# Altium project OBC_PhaseI.PrjPcb
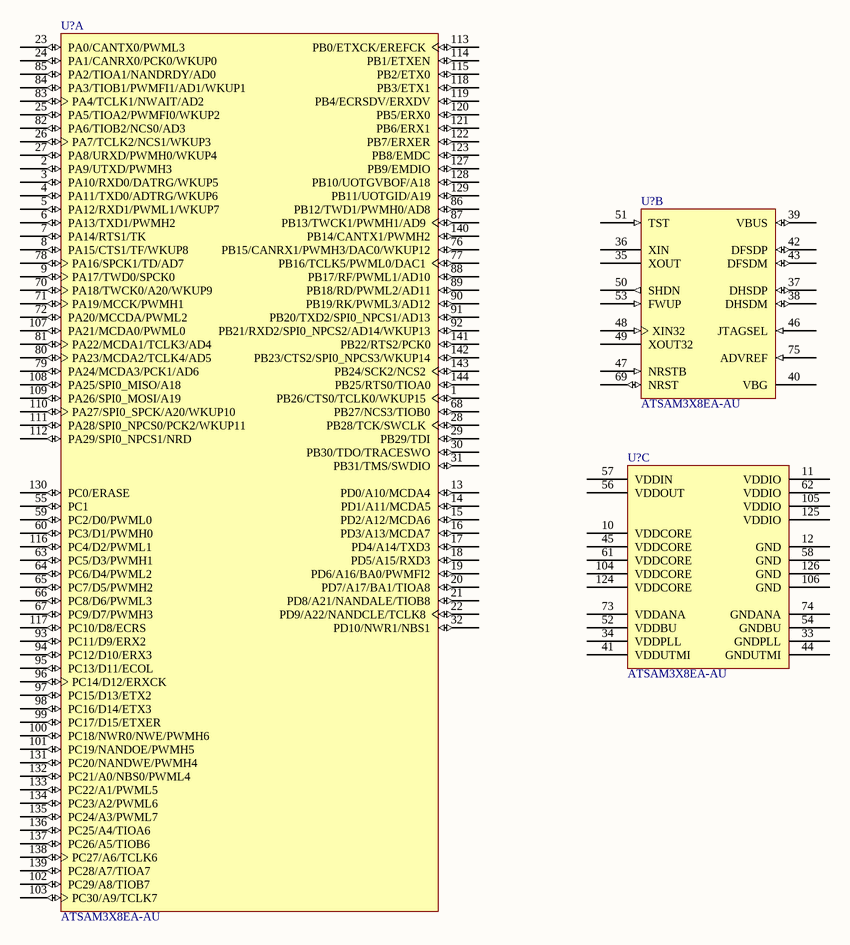
[diagram p0: OBC.SchDoc]
1 sheet, 3 parts. Net scope: global (net labels, ports and power ports of the same name join across sheets).

## Sheet OBC.SchDoc
size A4

### Parts
(Parts that share a designator on the sheet are numbered #1, #2 ... from top to bottom, then left to right.)
U?#1  ATSAM3X8EA-AU  [LQFP144_L]  (part A of 3)
U?#2  ATSAM3X8EA-AU  [LQFP144_L]  (part B of 3)
U?#3  ATSAM3X8EA-AU  [LQFP144_L]  (part C of 3)

### Nets

Not connected (* = marked no-connect by the designer): U?#1 1(PB26/CTS0/TCLK0/WKUP15) 2(PA9/UTXD/PWMH3) 3(PA10/RXD0/DATRG/WKUP5) 4(PA11/TXD0/ADTRG/WKUP6) 5(PA12/RXD1/PWML1/WKUP7) 6(PA13/TXD1/PWMH2) 7(PA14/RTS1/TK) 8(PA15/CTS1/TF/WKUP8) 9(PA17/TWD0/SPCK0) 13(PD0/A10/MCDA4) 14(PD1/A11/MCDA5) 15(PD2/A12/MCDA6) 16(PD3/A13/MCDA7) 17(PD4/A14/TXD3) 18(PD5/A15/RXD3) 19(PD6/A16/BA0/PWMFI2) 20(PD7/A17/BA1/TIOA8) 21(PD8/A21/NANDALE/TIOB8) 22(PD9/A22/NANDCLE/TCLK8) 23(PA0/CANTX0/PWML3) 24(PA1/CANRX0/PCK0/WKUP0) 25(PA5/TIOA2/PWMFI0/WKUP2) 26(PA7/TCLK2/NCS1/WKUP3) 27(PA8/URXD/PWMH0/WKUP4) 28(PB28/TCK/SWCLK) 29(PB29/TDI) 30(PB30/TDO/TRACESWO) 31(PB31/TMS/SWDIO) 32(PD10/NWR1/NBS1) 55(PC1) 59(PC2/D0/PWML0) 60(PC3/D1/PWMH0) 63(PC5/D3/PWMH1) 64(PC6/D4/PWML2) 65(PC7/D5/PWMH2) 66(PC8/D6/PWML3) 67(PC9/D7/PWMH3) 68(PB27/NCS3/TIOB0) 70(PA18/TWCK0/A20/WKUP9) 71(PA19/MCCK/PWMH1) 72(PA20/MCCDA/PWML2) 76(PB15/CANRX1/PWMH3/DAC0/WKUP12) 77(PB16/TCLK5/PWML0/DAC1) 78(PA16/SPCK1/TD/AD7) 79(PA24/MCDA3/PCK1/AD6) 80(PA23/MCDA2/TCLK4/AD5) 81(PA22/MCDA1/TCLK3/AD4) 82(PA6/TIOB2/NCS0/AD3) 83(PA4/TCLK1/NWAIT/AD2) 84(PA3/TIOB1/PWMFI1/AD1/WKUP1) 85(PA2/TIOA1/NANDRDY/AD0) 86(PB12/TWD1/PWMH0/AD8) 87(PB13/TWCK1/PWMH1/AD9) 88(PB17/RF/PWML1/AD10) 89(PB18/RD/PWML2/AD11) 90(PB19/RK/PWML3/AD12) 91(PB20/TXD2/SPI0_NPCS1/AD13) 92(PB21/RXD2/SPI0_NPCS2/AD14/WKUP13) 93(PC11/D9/ERX2) 94(PC12/D10/ERX3) 95(PC13/D11/ECOL) 96(PC14/D12/ERXCK) 97(PC15/D13/ETX2) 98(PC16/D14/ETX3) 99(PC17/D15/ETXER) 100(PC18/NWR0/NWE/PWMH6) 101(PC19/NANDOE/PWMH5) 102(PC29/A8/TIOB7) 103(PC30/A9/TCLK7) 107(PA21/MCDA0/PWML0) 108(PA25/SPI0_MISO/A18) 109(PA26/SPI0_MOSI/A19) 110(PA27/SPI0_SPCK/A20/WKUP10) 111(PA28/SPI0_NPCS0/PCK2/WKUP11) 112(PA29/SPI0_NPCS1/NRD) 113(PB0/ETXCK/EREFCK) 114(PB1/ETXEN) 115(PB2/ETX0) 116(PC4/D2/PWML1) 117(PC10/D8/ECRS) 118(PB3/ETX1) 119(PB4/ECRSDV/ERXDV) 120(PB5/ERX0) 121(PB6/ERX1) 122(PB7/ERXER) 123(PB8/EMDC) 127(PB9/EMDIO) 128(PB10/UOTGVBOF/A18) 129(PB11/UOTGID/A19) 130(PC0/ERASE) 131(PC20/NANDWE/PWMH4) 132(PC21/A0/NBS0/PWML4) 133(PC22/A1/PWML5) 134(PC23/A2/PWML6) 135(PC24/A3/PWML7) 136(PC25/A4/TIOA6) 137(PC26/A5/TIOB6) 138(PC27/A6/TCLK6) 139(PC28/A7/TIOA7) 140(PB14/CANTX1/PWMH2) 141(PB22/RTS2/PCK0) 142(PB23/CTS2/SPI0_NPCS3/WKUP14) 143(PB24/SCK2/NCS2) 144(PB25/RTS0/TIOA0); U?#2 35(XOUT) 36(XIN) 37(DHSDP) 38(DHSDM) 39(VBUS) 40(VBG) 42(DFSDP) 43(DFSDM) 46(JTAGSEL) 47(NRSTB) 48(XIN32) 49(XOUT32) 50(SHDN) 51(TST) 53(FWUP) 69(NRST) 75(ADVREF); U?#3 10(VDDCORE) 11(VDDIO) 12(GND) 33(GNDPLL) 34(VDDPLL) 41(VDDUTMI) 44(GNDUTMI) 45(VDDCORE) 52(VDDBU) 54(GNDBU) 56(VDDOUT) 57(VDDIN) 58(GND) 61(VDDCORE) 62(VDDIO) 73(VDDANA) 74(GNDANA) 104(VDDCORE) 105(VDDIO) 106(GND) 124(VDDCORE) 125(VDDIO) 126(GND)

### Library data of the parts
U?#1-U?#3 = CMP-0076-00188-1: SAM3X ARM Cortex-M3 Flash-based Microcontroller, 512 KB Flash, 96 KB SRAM, 103 User I/Os, 1.62 to 3.6 V, -40 to 85 degC, 144-Pin LQFP, RoHS; Manufacturer: Atmel; UART: 5; Max. Operating Freq.: 84 MHz; ADC Resolution: 12 bits; Flash: 512 Kbytes; ADC Channels: 16; SRAM: 96 Kbytes; Max I/O Pins: 103; DAC Channels: 2; SPI: 4; # of Touch Channels: 32; Mounting Technology: Surface Mount; Operating Voltage: 1.62 to 3.6 V; ComponentLink2URL: http://www.atmel.com/Images/doc11057.pdf; CAN: 2; ComponentLink1Description: Manufacturer URL; RoHS: TRUE; PartNumber: ATSAM3X8EA-AU; Temp. Range: -40 to 85 degC; PackageVersion: 11057B; PackageDescription: 100-Pin Quad Flat Package, Body 20 x 20 mm, Pitch 0.5 mm; ComponentLink2Description: Datasheet; DatasheetVersion: 11057B; ComponentLink1URL: http://www.atmel.com/; ComponentLink3Description: Package Specification; ComponentLink3URL: http://www.atmel.com/Images/doc11057.pdf; PackageReference: LQFP-144